# EAGLE design ESP8266-01-DHT11_V3 (EAGLE 6.2)
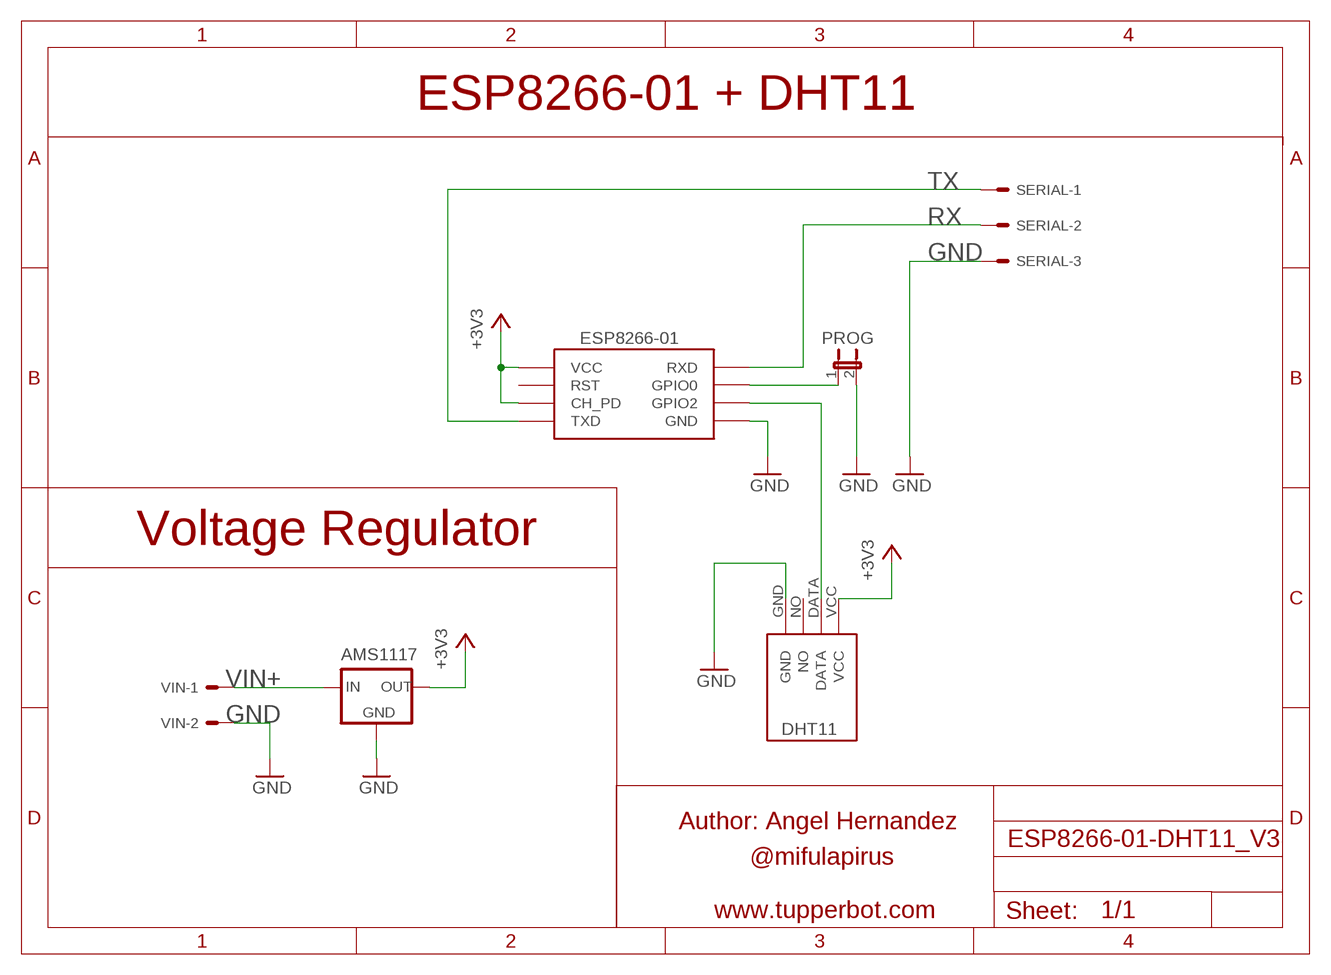
[diagram p0: schematic, sheet 1]

## Parts
AMS1117  LM1117  [SOT223]
ESP8266-01  ESP-01  [ESP-01]
PROG  JP1E  [JP1]
SERIAL  22-27-2031-03  [6410-03]
U$2  DHT11-PION.  [DHT11-PION.]
VIN  22-27-2021-02  [6410-02]

## Nets
+3V3: AMS1117.2(OUT) ESP8266-01.CH_PD ESP8266-01.VCC U$2.VCC
GND: AMS1117.1(GND) ESP8266-01.GND PROG.2 SERIAL.3 U$2.GND VIN.2
N$1: ESP8266-01.GPIO0 PROG.1
N$4: ESP8266-01.GPIO2 U$2.DATA
RX: ESP8266-01.RX(RXD) SERIAL.2
TX: ESP8266-01.TX(TXD) SERIAL.1
VIN+: AMS1117.3(IN) VIN.1
Unconnected: ESP8266-01.RST U$2.NO

## Notes on the sheet
- ESP8266-01 + DHT11
- Voltage Regulator
- Author: Angel Hernandez
- @mifulapirus
- www.tupperbot.com

## Library data of the parts
AMS1117 = v-reg-2:LM1117
ESP8266-01 = esp8266modules:ESP-01: ESP8266 Wifi Module ESP-01; DIMENSIONS: 14.3 x 24.8 mm; PINS: 8; PITCH: 0.1" / 2.54 mm
PROG = jumper:JP1E: JUMPER
SERIAL = con-molex:22-?-03: CONNECTOR wire to board 2.54 mm (.1 inch) pitch header; OC_FARNELL: unknown; OC_NEWARK: unknown
U$2 = DHT11:DHT11-PION.: DHT11 Czujnik temperatury i wilgotności (widok pionowy)
VIN = con-molex:22-?-02: CONNECTOR wire to board 2.54 mm (.1 inch) pitch header; OC_FARNELL: unknown; OC_NEWARK: unknown

## Board
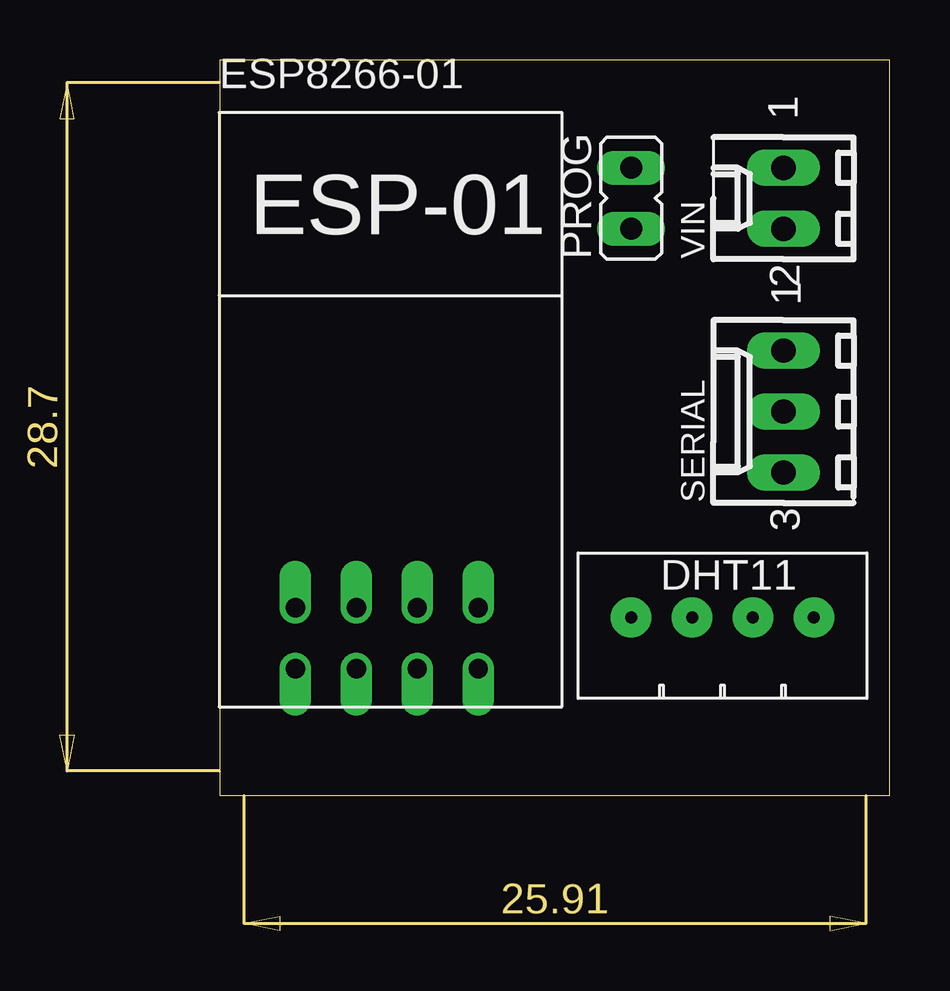
[diagram p1: board, top side]
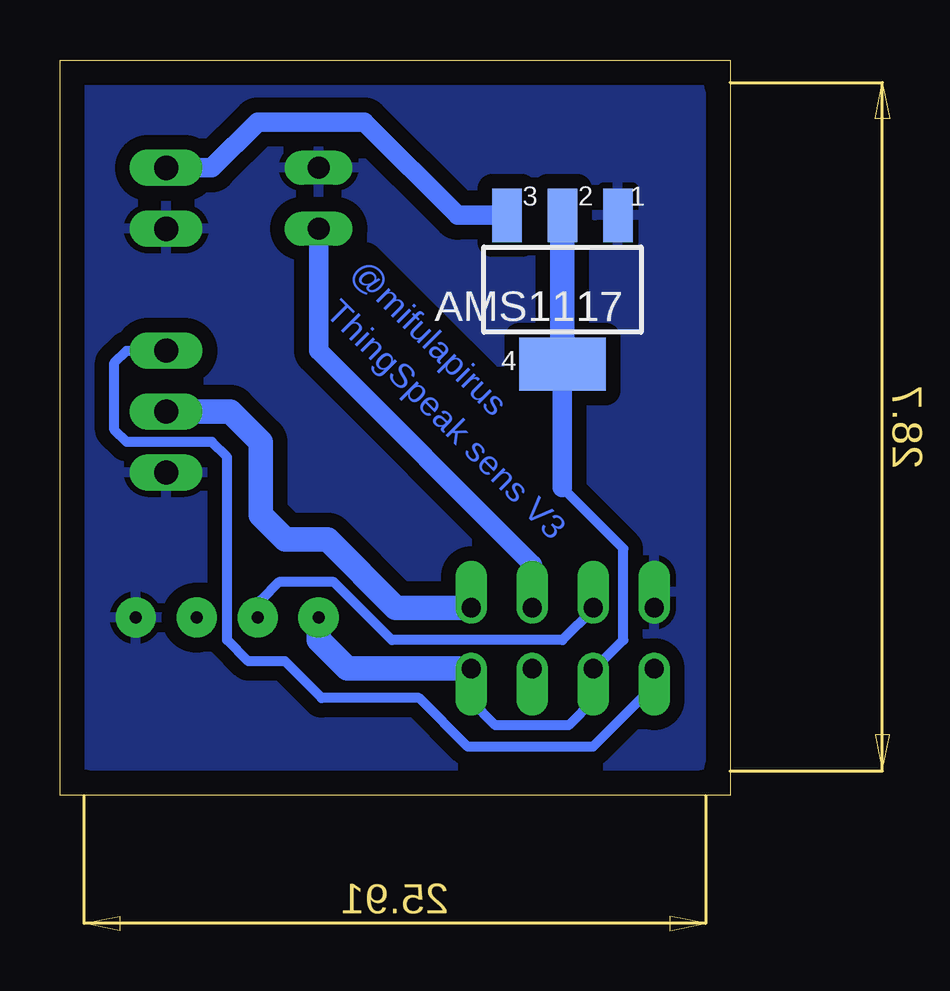
[diagram p2: board, bottom side, seen from below]

Size 27.92 x 30.66 mm. Coordinates in mm from the lower left corner, seen from the top.
Outline: 0,0 27.92,0 27.92,30.66 0,30.66 0,0
Copper layers (1*16): Top 0.035mm / dielectric 1.5mm / Bottom 0.035mm
Design rules: minimum track width 10mil, minimum drill 24mil, track to track 8mil, track to pad 8mil, pad to pad 8mil, via to via 8mil, smd to smd 8mil, copper to edge 40mil, drill to drill 8mil, minimum pad ring 10mil, minimum via ring 8mil, stop-mask expansion 4mil, vias tented up to drill 0mil, thermal gap 10mil

### Footprints (pad centres in the part's own frame; a part is rotated, then mirrored left to right if it is on the bottom)
SOT223 = smd 1.219 x 2.235: 1 -2.311,-3.099; 2 0,-3.099; 3 2.311,-3.099 | smd 3.6 x 2.2: 4 0,3.099
ESP-01 = drill 0.8 offset: CH_PD -1.285,-8.178; GND -3.825,-5.638; GPIO0 1.255,-5.638; GPIO2 -1.285,-5.638; RST 1.255,-8.178; RX 3.795,-5.638; TX -3.825,-8.178; VCC 3.795,-8.178
JP1 = drill 0.914 long: 1 0,-1.27; 2 0,1.27
6410-03 = drill 1.016 long: 1 2.54,0; 2 0,0; 3 -2.54,0
DHT11-PION. = drill 0.5 pad 1.676: DATA -1.27,0.305; GND 3.81,0.305; NO 1.27,0.305; VCC -3.81,0.305
6410-02 = drill 1.016 long: 1 1.27,0; 2 -1.27,0

### Placement (x,y rotation side)
AMS1117  6.99,21.08 180 bottom
ESP8266-01  6.99,13.46 0 top
PROG  17.14,24.89 0 top
SERIAL  23.5,16 90 top
U$2  20.95,7.11 0 top
VIN  23.5,24.89 90 top

### Tracks (layer width: path | path; a pad name or v marks a point on that pad's centre or on a via)
+3V3
  Bottom 0.406: 6.99,12.83 4.45,10.29 4.45,6.48 5.64,5.28 ESP8266-01.CH_PD 5.7,3.95 6.73,2.92 9.78,2.92 10.79,3.94 10.79,5.27 ESP8266-01.VCC
  Bottom 0.813: 6.99,12.83 6.99,17.91
  Bottom 1.016: ESP8266-01.VCC 15.95,5.28 17.14,6.48 U$2.VCC | AMS1117.2 6.99,17.91
GND
  pour Bottom (isolate 0.61): 0,29.97 27.3,29.97 27.3,0.25 0,0.25
N$1
  Bottom 0.813: ESP8266-01.GPIO0 8.24,9.64 17.14,18.54 PROG.1
N$4
  Bottom 0.406: ESP8266-01.GPIO2 5.7,7.76 6.99,6.48 14.1,6.48 16.51,8.89 18.8,8.89 19.56,8.13 19.56,7.54 U$2.DATA
RX
  Bottom 1.016: ESP8266-01.RX 13.92,7.82 16.76,10.67 18.54,10.67 19.56,11.68 19.56,14.73 20.83,16 SERIAL.2
TX
  Bottom 0.406: ESP8266-01.TX 3.16,4.59 5.71,2.03 10.92,2.03 12.95,4.06 17.02,4.06 18.54,5.59 20.07,5.59 20.95,6.48 20.95,14.1 21.59,14.73 25.15,14.73 25.65,15.24 25.65,18.03 25.15,18.54 SERIAL.1
VIN+
  Bottom 0.813: AMS1117.3 11.35,24.18 15.24,28.07 19.68,28.07 21.59,26.16 VIN.1

### Text on the board
Bottom: @mifulapirus | ThingSpeak sens V3